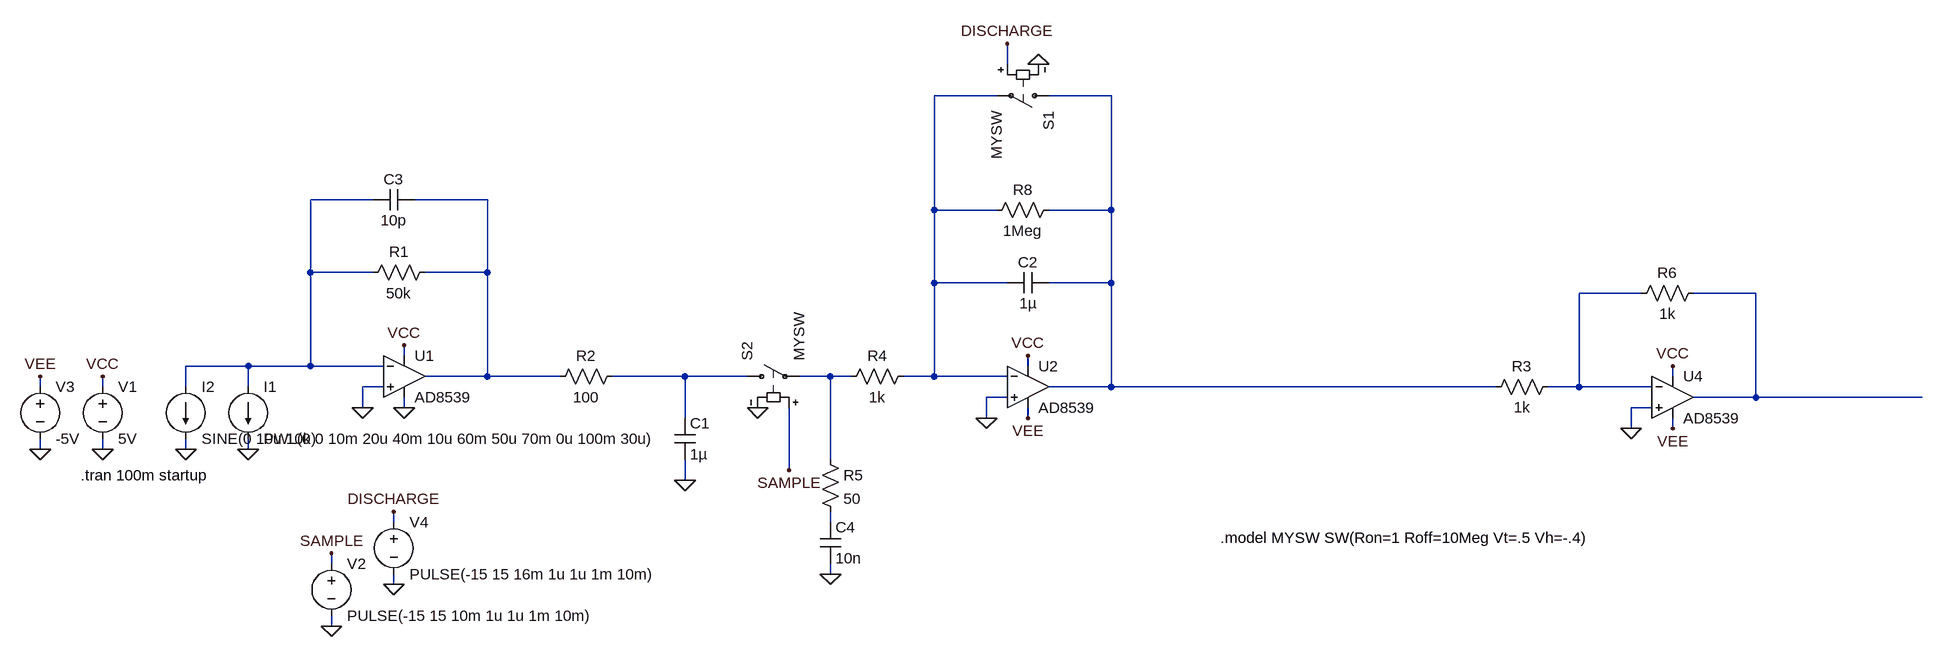
[diagram p0: schematic Detector.asc]
Detector.asc, the LTspice schematic file:
Version 4
SHEET 1 2804 680
WIRE 1296 -368 1296 -400
WIRE 1280 -320 1184 -320
WIRE 1456 -320 1360 -320
WIRE 320 -160 224 -160
WIRE 496 -160 384 -160
WIRE 1184 -144 1184 -320
WIRE 1280 -144 1184 -144
WIRE 1456 -144 1456 -320
WIRE 1456 -144 1360 -144
WIRE 224 -48 224 -160
WIRE 320 -48 224 -48
WIRE 496 -48 496 -160
WIRE 496 -48 400 -48
WIRE 1184 -32 1184 -144
WIRE 1296 -32 1184 -32
WIRE 1456 -32 1456 -144
WIRE 1456 -32 1360 -32
WIRE 2272 -16 2176 -16
WIRE 2448 -16 2352 -16
WIRE 368 80 368 64
WIRE 128 96 32 96
WIRE 224 96 224 -48
WIRE 224 96 128 96
WIRE 336 96 224 96
WIRE 1328 96 1328 80
WIRE 496 112 496 -48
WIRE 496 112 400 112
WIRE 608 112 496 112
WIRE 800 112 688 112
WIRE 896 112 800 112
WIRE 1024 112 976 112
WIRE 1056 112 1024 112
WIRE 1184 112 1184 -32
WIRE 1184 112 1136 112
WIRE 1296 112 1184 112
WIRE 2320 112 2320 96
WIRE -192 128 -192 112
WIRE -96 128 -96 112
WIRE 32 128 32 96
WIRE 128 128 128 96
WIRE 336 128 304 128
WIRE 1456 128 1456 -32
WIRE 1456 128 1360 128
WIRE 2048 128 1456 128
WIRE 2176 128 2176 -16
WIRE 2176 128 2128 128
WIRE 2288 128 2176 128
WIRE 1296 144 1264 144
WIRE 2448 144 2448 -16
WIRE 2448 144 2352 144
WIRE 2704 144 2448 144
WIRE 304 160 304 128
WIRE 368 160 368 144
WIRE 2288 160 2256 160
WIRE 800 176 800 112
WIRE 1264 176 1264 144
WIRE 1328 176 1328 160
WIRE 2256 192 2256 160
WIRE 2320 192 2320 176
WIRE -192 224 -192 208
WIRE -96 224 -96 208
WIRE 32 224 32 208
WIRE 128 224 128 208
WIRE 1024 240 1024 112
WIRE 960 256 960 160
WIRE 800 272 800 240
WIRE 352 336 352 320
WIRE 1024 336 1024 320
WIRE 256 400 256 384
WIRE 1024 416 1024 400
WIRE 352 432 352 416
WIRE 256 496 256 480
FLAG 368 64 VCC
FLAG 368 160 0
FLAG 304 160 0
FLAG 32 224 0
FLAG -96 224 0
FLAG -96 112 VCC
FLAG 1328 80 VCC
FLAG 256 496 0
FLAG 256 384 SAMPLE
FLAG -192 224 0
FLAG -192 112 VEE
FLAG 1328 176 VEE
FLAG 1264 176 0
FLAG 2256 192 0
FLAG 2320 96 VCC
FLAG 2320 192 VEE
FLAG 352 432 0
FLAG 352 320 DISCHARGE
FLAG 960 256 SAMPLE
FLAG 1296 -400 DISCHARGE
FLAG 1344 -368 0
FLAG 912 160 0
FLAG 1024 416 0
FLAG 128 224 0
FLAG 800 272 0
SYMBOL current 128 128 R0
WINDOW 123 0 0 Left 0
WINDOW 39 0 0 Left 0
SYMATTR InstName I1
SYMATTR Value PWL(0 0 10m 20u 40m 10u 60m 50u 70m 0u 100m 30u)
SYMBOL Opamps\\AD8539 368 48 R0
SYMATTR InstName U1
SYMBOL res 416 -64 R90
WINDOW 0 0 56 VBottom 2
WINDOW 3 32 56 VTop 2
SYMATTR InstName R1
SYMATTR Value 50k
SYMBOL voltage -96 112 R0
WINDOW 123 0 0 Left 0
WINDOW 39 0 0 Left 0
SYMATTR InstName V1
SYMATTR Value 5V
SYMBOL cap 1360 -48 R90
WINDOW 0 0 32 VBottom 2
WINDOW 3 32 32 VTop 2
SYMATTR InstName C2
SYMATTR Value 1µ
SYMBOL Opamps\\AD8539 1328 64 R0
SYMATTR InstName U2
SYMBOL voltage 256 384 R0
WINDOW 123 0 0 Left 0
WINDOW 39 0 0 Left 0
SYMATTR InstName V2
SYMATTR Value PULSE(-15 15 10m 1u 1u 1m 10m)
SYMBOL voltage -192 112 R0
WINDOW 123 0 0 Left 0
WINDOW 39 0 0 Left 0
SYMATTR InstName V3
SYMATTR Value -5V
SYMBOL Opamps\\AD8539 2320 80 R0
SYMATTR InstName U4
SYMBOL res 2368 -32 R90
WINDOW 0 0 56 VBottom 2
WINDOW 3 32 56 VTop 2
SYMATTR InstName R6
SYMATTR Value 1k
SYMBOL res 2144 112 R90
WINDOW 0 0 56 VBottom 2
WINDOW 3 32 56 VTop 2
SYMATTR InstName R3
SYMATTR Value 1k
SYMBOL voltage 352 320 R0
WINDOW 123 0 0 Left 0
WINDOW 39 0 0 Left 0
SYMATTR InstName V4
SYMATTR Value PULSE(-15 15 16m 1u 1u 1m 10m)
SYMBOL sw 1376 -320 R90
SYMATTR InstName S1
SYMATTR Value MYSW
SYMBOL res 1152 96 R90
WINDOW 0 0 56 VBottom 2
WINDOW 3 32 56 VTop 2
SYMATTR InstName R4
SYMATTR Value 1k
SYMBOL res 1376 -160 R90
WINDOW 0 0 56 VBottom 2
WINDOW 3 32 56 VTop 2
SYMATTR InstName R8
SYMATTR Value 1Meg
SYMBOL sw 880 112 R270
SYMATTR InstName S2
SYMATTR Value MYSW
SYMBOL cap 384 -176 R90
WINDOW 0 0 32 VBottom 2
WINDOW 3 32 32 VTop 2
SYMATTR InstName C3
SYMATTR Value 10p
SYMBOL cap 1008 336 R0
SYMATTR InstName C4
SYMATTR Value 10n
SYMBOL res 1008 224 R0
SYMATTR InstName R5
SYMATTR Value 50
SYMBOL current 32 128 R0
WINDOW 123 0 0 Left 0
WINDOW 39 0 0 Left 0
SYMATTR InstName I2
SYMATTR Value SINE(0 10u 10k)
SYMBOL res 704 96 R90
WINDOW 0 0 56 VBottom 2
WINDOW 3 32 56 VTop 2
SYMATTR InstName R2
SYMATTR Value 100
SYMBOL cap 784 176 R0
SYMATTR InstName C1
SYMATTR Value 1µ
TEXT -130 264 Left 2 !.tran 100m startup
TEXT 1624 360 Left 2 !.model MYSW SW(Ron=1 Roff=10Meg Vt=.5 Vh=-.4)

The netlist it stands for:
* Detector.asc
I1 N003 0 PWL(0 0 10m 20u 40m 10u 60m 50u 70m 0u 100m 30u)
XU1 0 N003 VCC 0 N004 AD8539  ; pins In+ In- V+ V- OUT
R1 N004 N003 50k
V1 VCC 0 5V
C2 N002 N001 1µ
XU2 0 N001 VCC VEE N002 AD8539  ; pins In+ In- V+ V- OUT
V2 SAMPLE 0 PULSE(-15 15 10m 1u 1u 1m 10m)
V3 VEE 0 -5V
XU4 0 N005 VCC VEE N006 AD8539  ; pins In+ In- V+ V- OUT
R6 N006 N005 1k
R3 N005 N002 1k
V4 DISCHARGE 0 PULSE(-15 15 16m 1u 1u 1m 10m)
S1 N002 N001 DISCHARGE 0 MYSW
R4 N001 N008 1k
R8 N002 N001 1Meg
S2 N007 N008 SAMPLE 0 MYSW
C3 N004 N003 10p
C4 N009 0 10n
R5 N008 N009 50
I2 N003 0 SINE(0 10u 10k)
R2 N007 N004 100
C1 N007 0 1µ
.tran 100m startup
.model MYSW SW(Ron=1 Roff=10Meg Vt=.5 Vh=-.4)
.backanno
.end